# Altium schematic sheet pwr_sen_brd.SchDoc
size A4
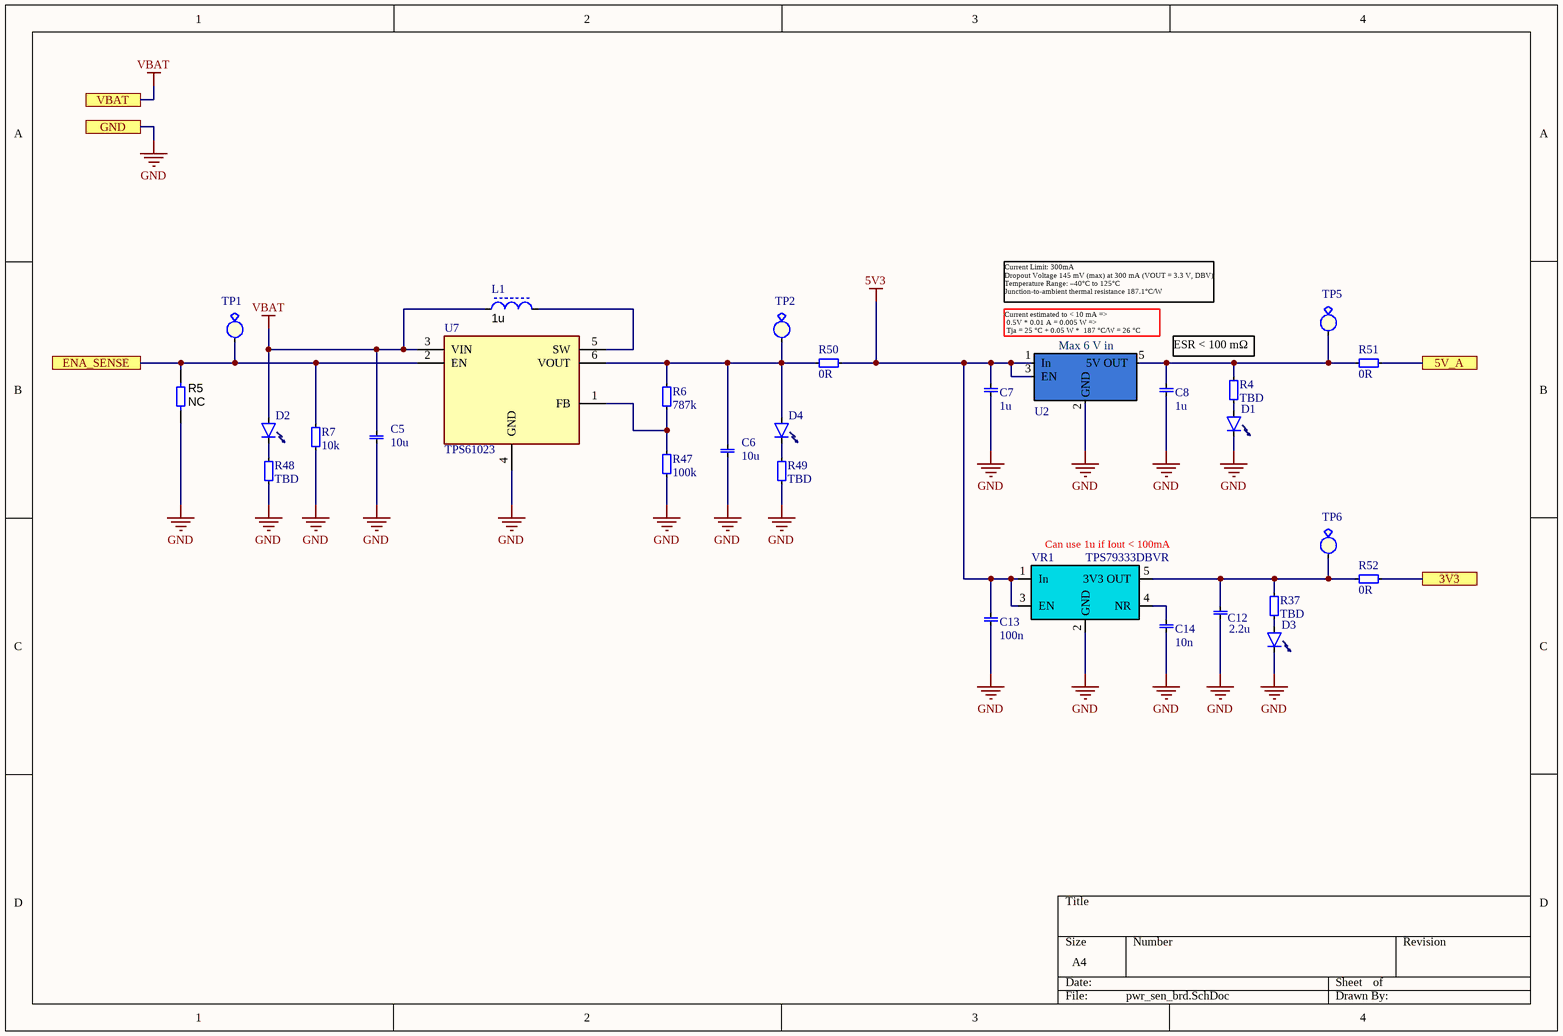
[diagram p0: pwr_sen_brd.SchDoc]

## Parts
C5  value 10u  [1206, capasitor]  (hidden comment: 1206, capacitor)
C6  value 10u  [1206, capasitor]  (hidden comment: 1206, capacitor)
C7  value 1u  [0402 CAP]  (hidden comment: 0603, capacitor)
C8  value 1u  [0402 CAP]  (hidden comment: 0603, capacitor)
C12  value 2.2u  [0402 CAP]  (hidden comment: 0603, capacitor)
C13  value 100n  [0402 CAP]  (hidden comment: 0603, capacitor)
C14  value 10n  [0603 cap]  (hidden comment: 0603, capacitor)
D1  0603, LED  [0603 LED]  (value not drawn)
D2  0603, LED  [0603 LED]  (value not drawn)
D3  0603, LED  [0603 LED]  (value not drawn)
D4  0603, LED  [0603 LED]  (value not drawn)
L1  value 1u  [74404043010A]  (hidden comment: Inductor, 74404043010A)
R4  value TBD  [0402 res]  (hidden comment: 0603, resistor)
R5  value NC  [0603]  (hidden comment: RES, 0603)
R6  value 787k  [0402 res]  (hidden comment: 0603, resistor)
R7  value 10k  [0402 res]  (hidden comment: 0603, resistor)
R37  value TBD  [0402 res]  (hidden comment: 0603, resistor)
R47  value 100k  [0402 res]  (hidden comment: 0603, resistor)
R48  value TBD  [0402 res]  (hidden comment: 0603, resistor)
R49  value TBD  [0402 res]  (hidden comment: 0603, resistor)
R50  value 0R  [0603]  (hidden comment: 0603, resistor)
R51  value 0R  [0603]  (hidden comment: 0603, resistor)
R52  value 0R  [0603]  (hidden comment: 0603, resistor)
TP1  Test Point  [TESTPOINT_SMD]  (value not drawn)
TP2  Test Point  [TESTPOINT_SMD]  (value not drawn)
TP5  Test Point  [TESTPOINT_SMD]  (value not drawn)
TP6  Test Point  [TESTPOINT_SMD]  (value not drawn)
U2  TPS7A20  [SOT23-5]  (value not drawn)
U7  TPS61023  [SOT50P160X60-6N]
VR1  TPS79333DBVR  [SOT23-5]

## Ports
3V3, 5V_A, ENA_SENSE, GND, VBAT

## Nets
5V3: C7.1 C13.1 R50.0 U2.1(In) U2.3(EN) VR1.1(In) VR1.3(EN)
GND: C5.0 C6.0 C7.0 C8.0 C12.0 C13.0 C14.0 D1.0(Cathode) D3.0(Cathode) R5.1 R7.1 R47.1 R48.1 R49.1 U2.2(GND) U7.4(GND) VR1.2(GND) ; port GND
VBAT: C5.1 D2.1 L1.2 U7.3(VIN) ; port VBAT
3V3: R52.0 ; port 3V3
5V_A: R51.0 ; port 5V_A
ENA_SENSE: R5.2 R7.0 TP1.0 U7.2(EN) ; port ENA_SENSE
NetC6_1: C6.1 D4.1 R6.0 R50.1 TP2.0 U7.6(VOUT)
NetC8_1: C8.1 R4.1 R51.1 TP5.0 U2.5(5V_OUT)
NetC12_1: C12.1 R37.1 R52.1 TP6.0 VR1.5(3V3_OUT)
NetC14_1: C14.1 VR1.4(NR)
NetD1_1: D1.1 R4.0
NetD2_0: D2.0(Cathode) R48.0
NetD3_1: D3.1 R37.0
NetD4_0: D4.0(Cathode) R49.0
NetL1_1: L1.1 U7.5(SW)
NetR6_1: R6.1 R47.0 U7.1(FB)

## Notes on the sheet
- Current Limit: 300mA
  Dropout Voltage 145 mV (max) at 300 mA (VOUT = 3.3 V, DBV)
  Temperature Range: –40°C to 125°C
  Junction-to-ambient thermal resistance 187.1°C/W
- (near U2) Current estimated to < 10 mA =>
  0.5V * 0.01 A = 0.005 W =>
  Tja = 25 °C + 0.05 W *  187 °C/W = 26 °C
- ESR < 100 mΩ
- (near VR1) Can use 1u if Iout < 100mA
- (in symbol TPS7A20) Max 6 V in

## Library data of the parts
C5 C6 = 1206, capacitor: GRM155R61A106ME11D; Manufacturer Part No: CL31A106KAHNNNE
C7 C8 = 0603, capacitor: Manufacturer Part No: CL05A105KO5NNNC
C12 = 0603, capacitor: Manufacturer Part No: GRM155D71A225ME15D
C13 = 0603, capacitor: Manufacturer Part No: GRM155R62A104KE14D
C14 = 0603, capacitor: Manufacturer Part No: CL10B103KB8NNNC
D1 D3 = 0603, LED: Manufacturer Part No: 150060SS75003
D2 D4 = 0603, LED: Manufacturer Part No: 5988081107F
L1 = Inductor, 74404043010A: Shielded Power Inductor with Ferrite Core; SRF: 167 MHz; DC Resistance: 14 mOhm; PartNumber: 74404043010A; Manufacturer Part No: 74404043010A
R6 = 0603, resistor: RES 787K OHM 1% 1/16W 0402; Manufacturer Part No: RC0402FR-07787KL
R7 = 0603, resistor: Manufacturer Part No: 311-10.0KLRCT-ND
R47 = 0603, resistor: Manufacturer Part No: RC0402FR-07100KL
R50-R52 = 0603, resistor: Manufacturer Part No: CRCW06030000Z0EA
U2 = TPS7A20: 5V and 300-mA, Ultra-Low-Noise, Low-IQ, High PSRR LDO; Manufacturer Part No: TPS7A2050PDBVR
U7 = TPS61023: TPS61023 3.7-A Boost Converter with 0.5-V Ultra-low Input Voltage; Manufacturer Part No: TPS61023DRLT; Order code: 595-TPS61023DRLT; Cost (kr): 12,54; Supplier: Mouser
VR1 = TPS79333DBVR: Low Dropout Regulators(LDO) Positive Fixed 180mV @ 200mA 5.5V 3.3V 200mA SOT-23-5 RoHS; Dropout Voltage: 102mV; Manufacturer Part No: TPS79333DBVR
R5 = RES, 0603: ComponentLink1Description: Datasheet link; ComponentLink1URL: http://www.vishay.com/docs/28705/mcx0x0xpro.pdf
TP1 TP2 TP5 TP6 = Test Point: Value: Test point; Farnell: 1702006